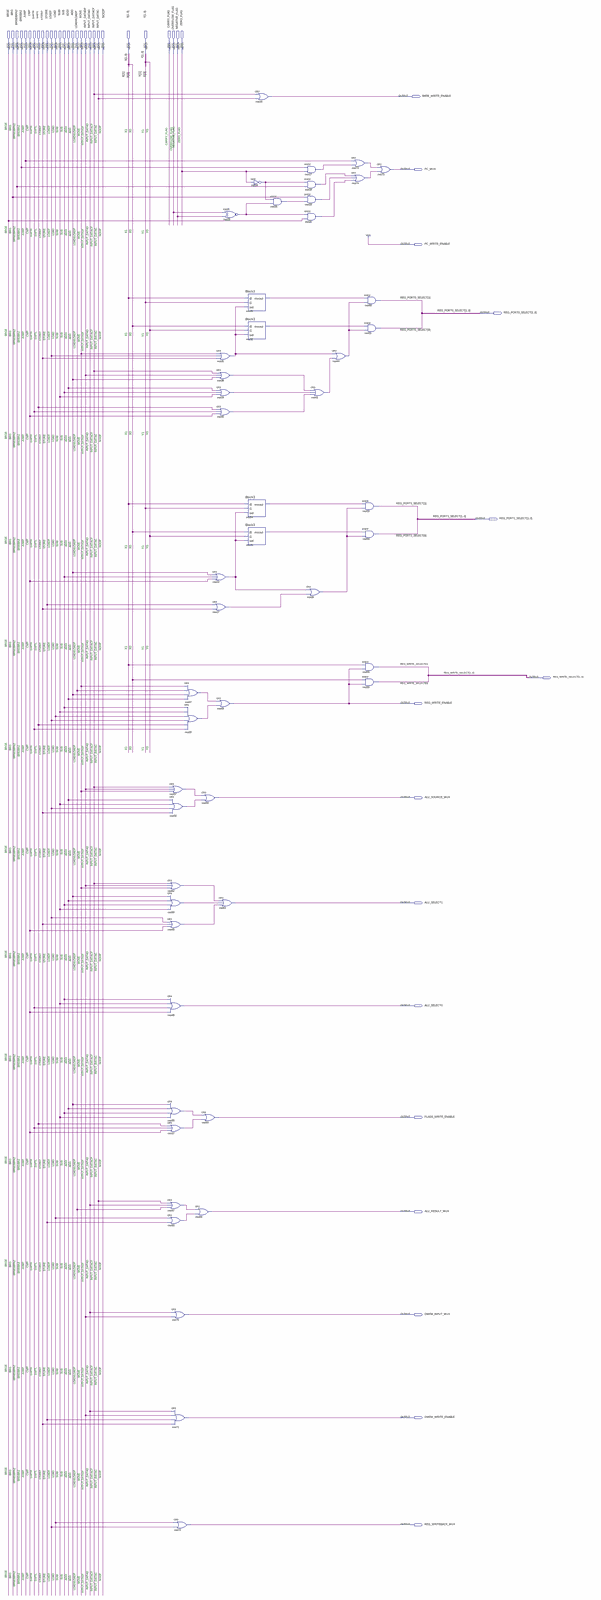
[diagram p0: schematic sheet, whole]
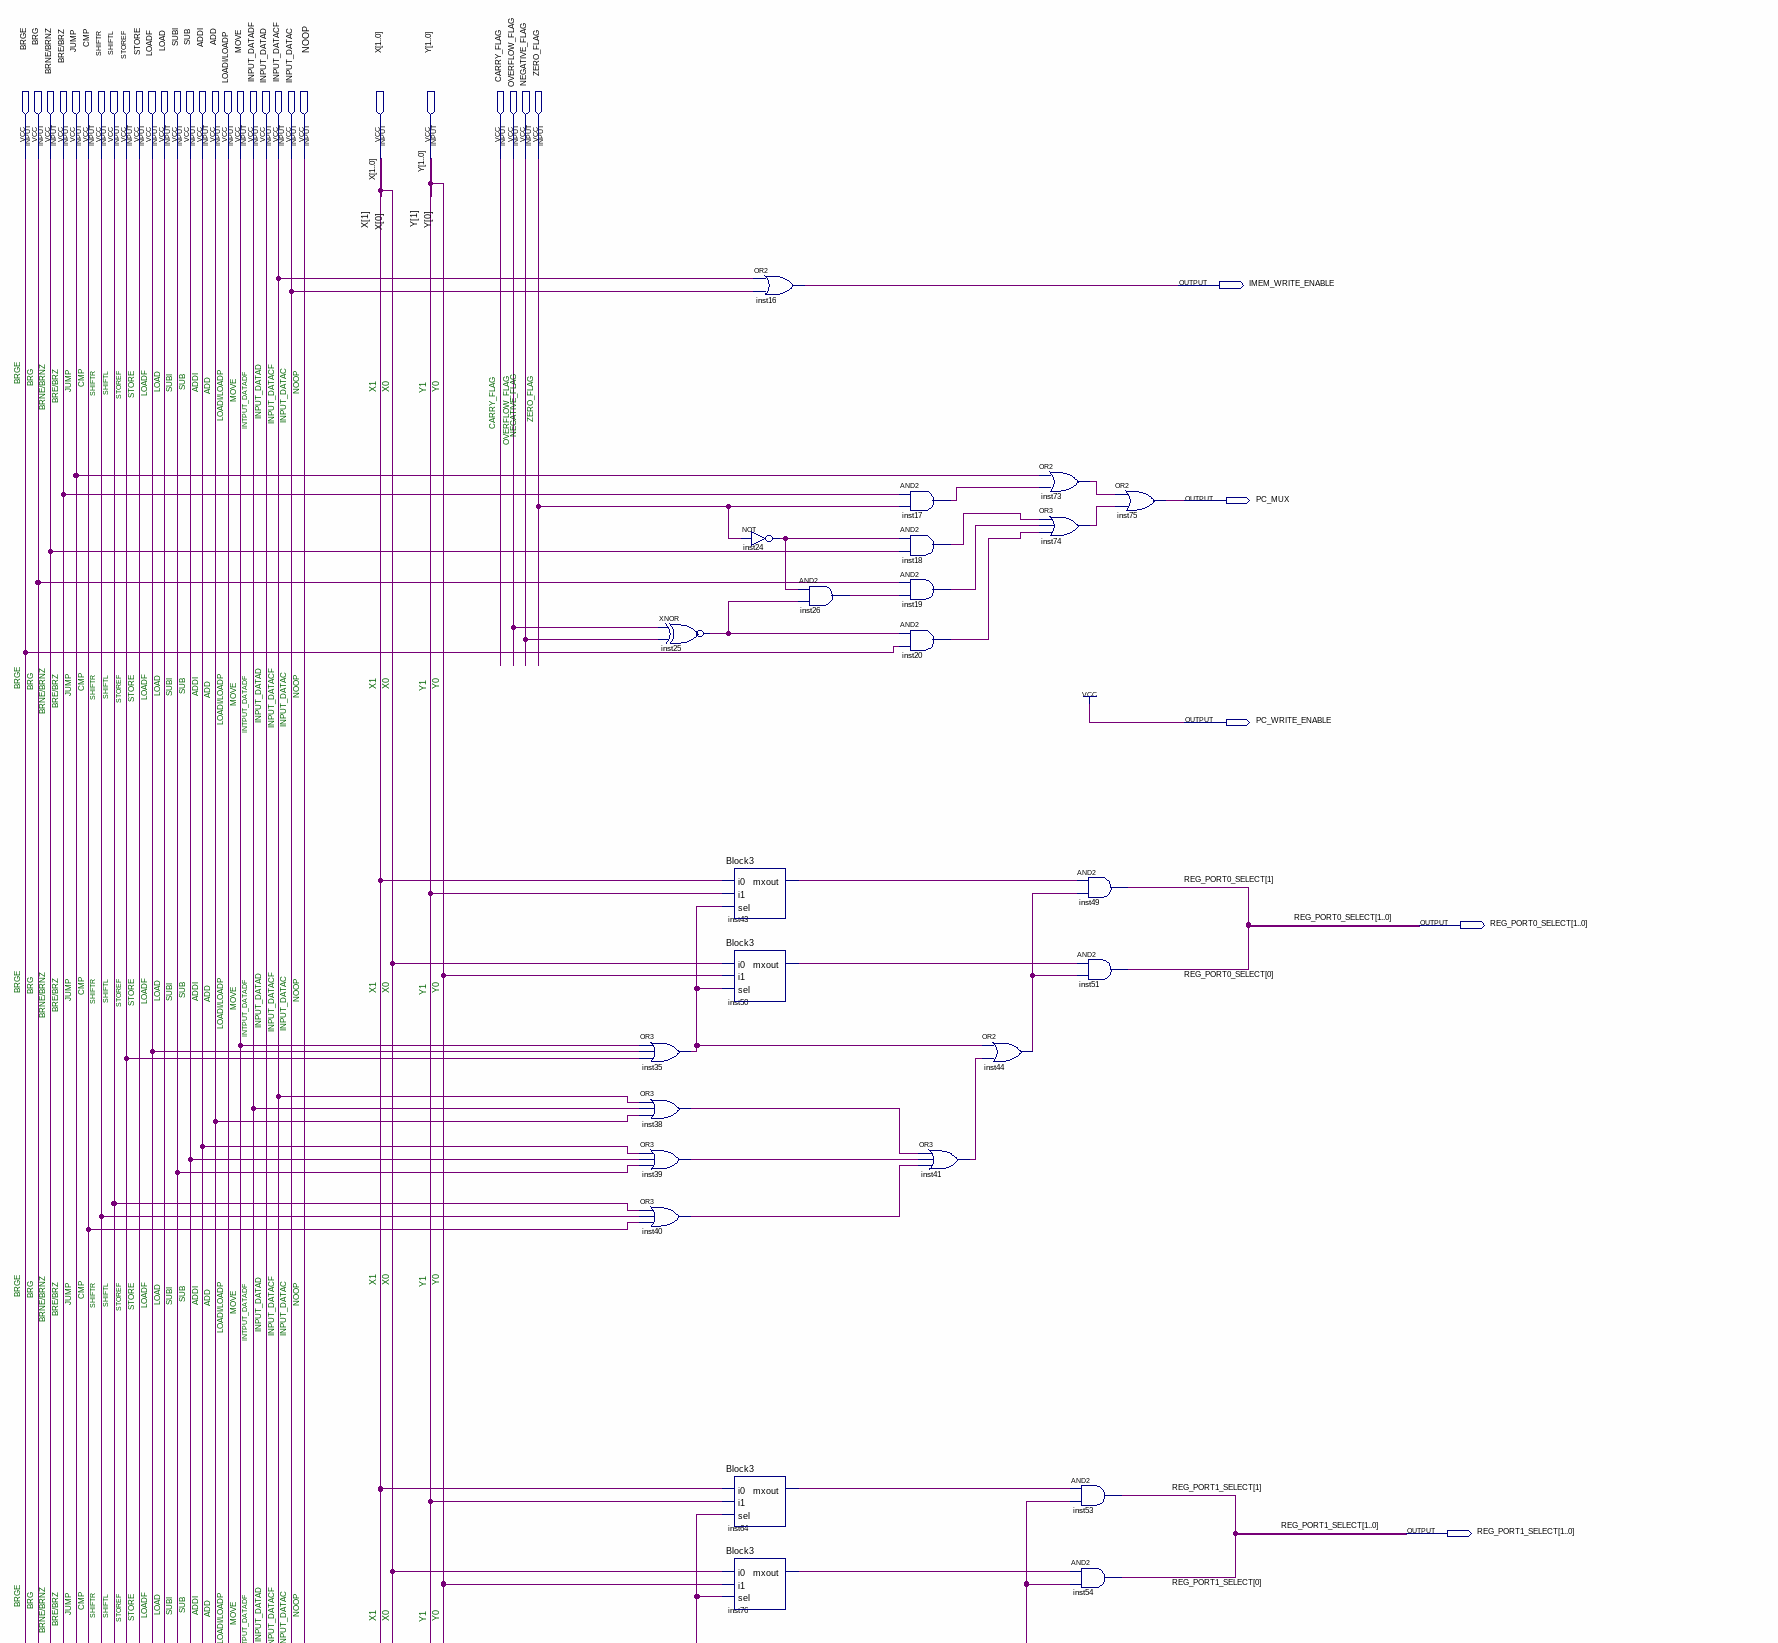
[diagram p1: schematic sheet, upper part]
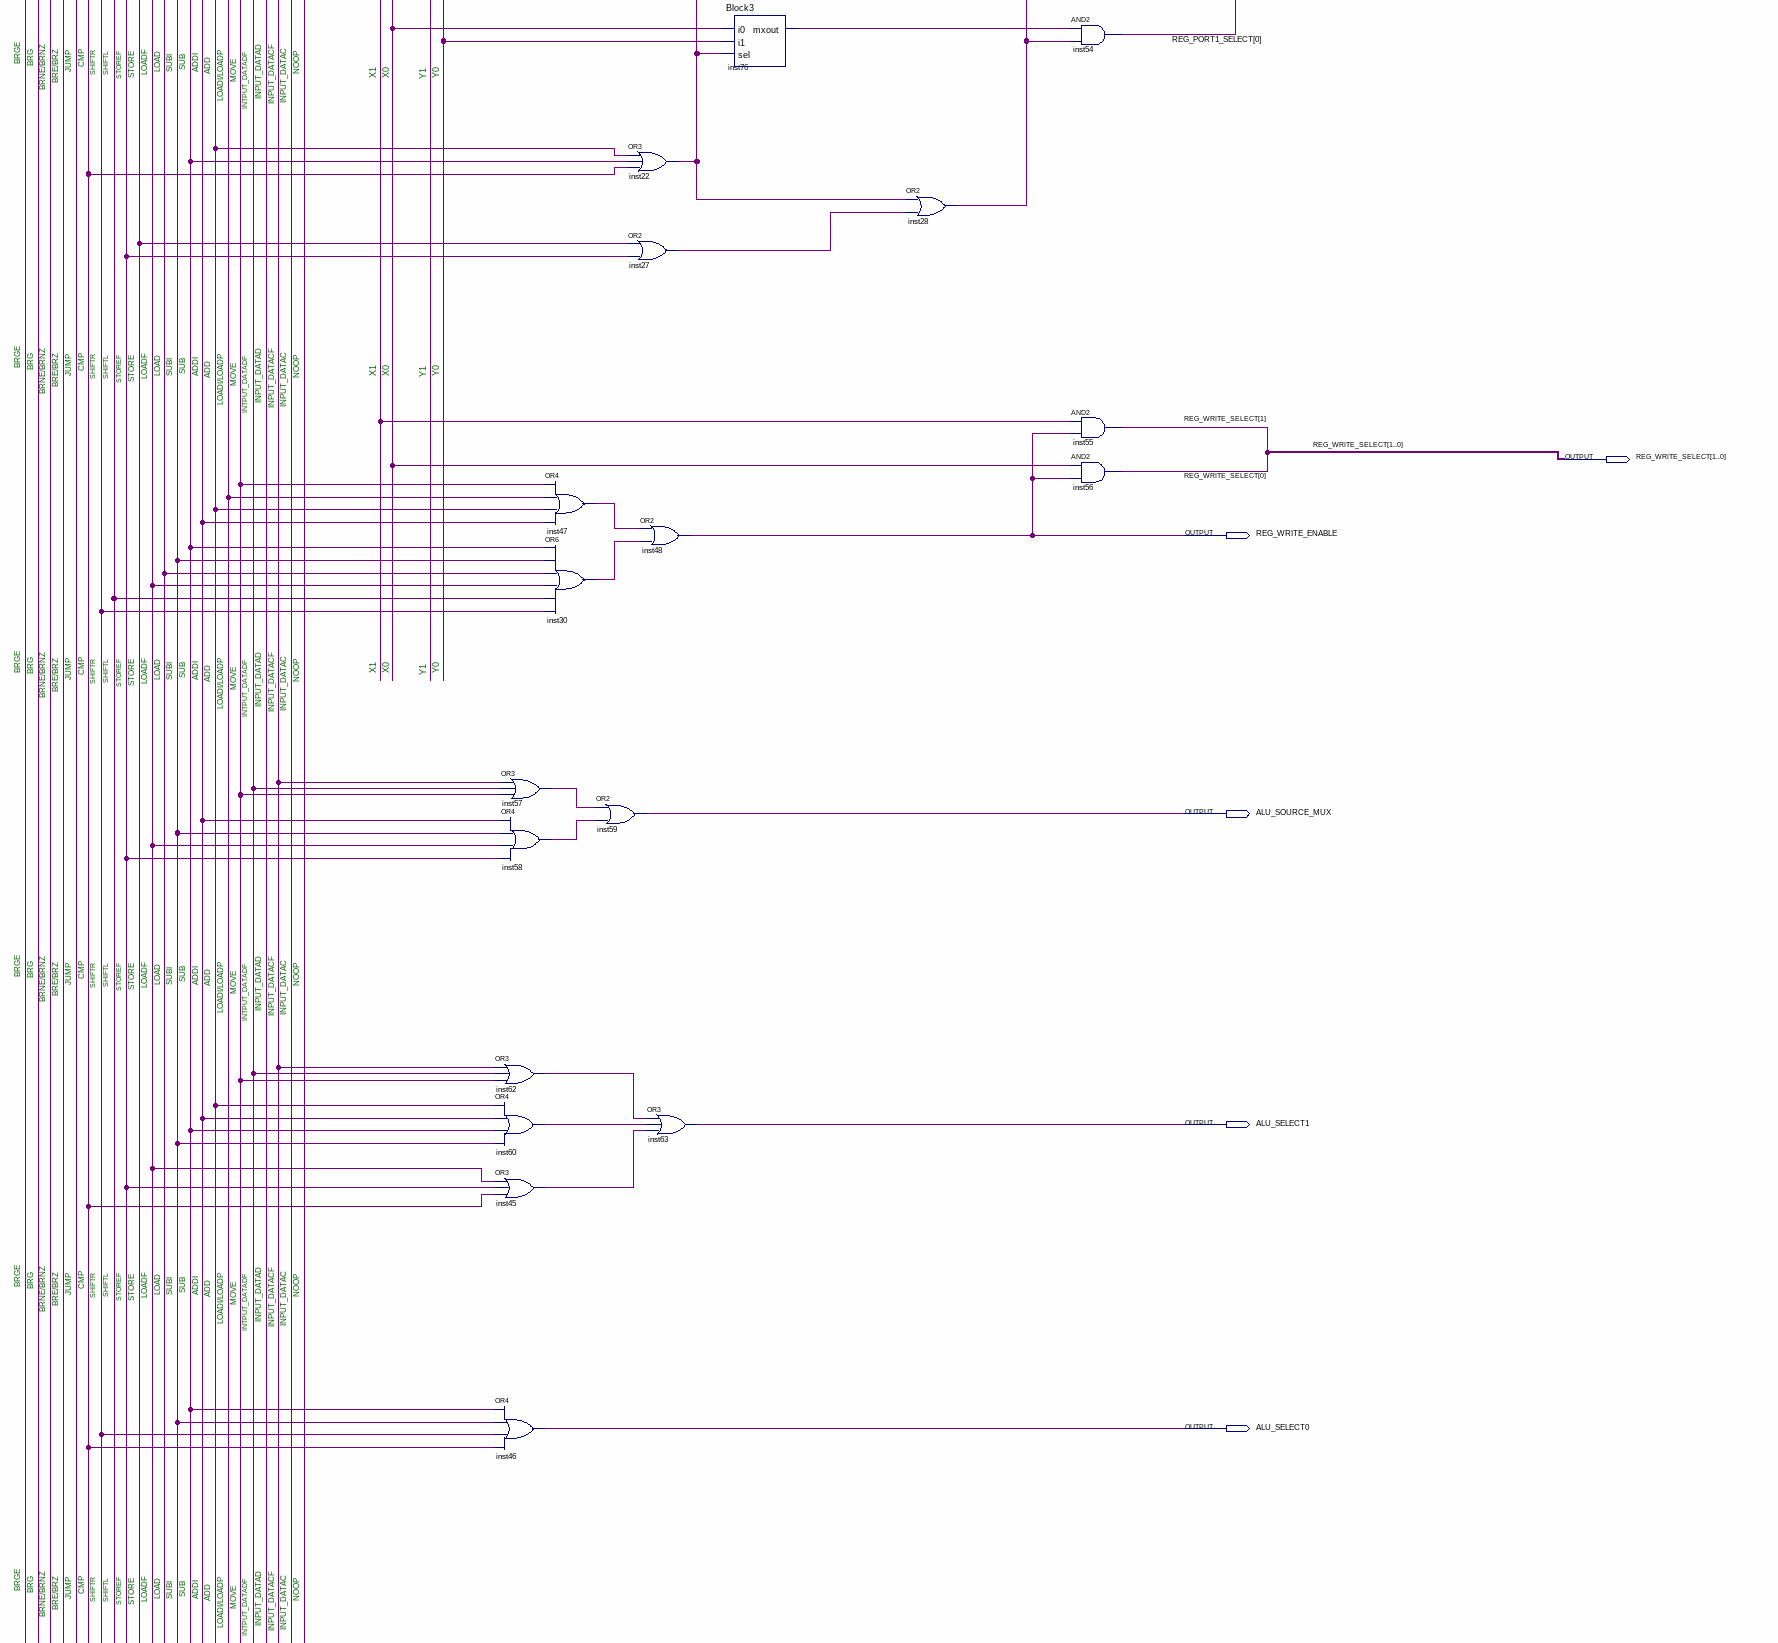
[diagram p2: schematic sheet, middle part]
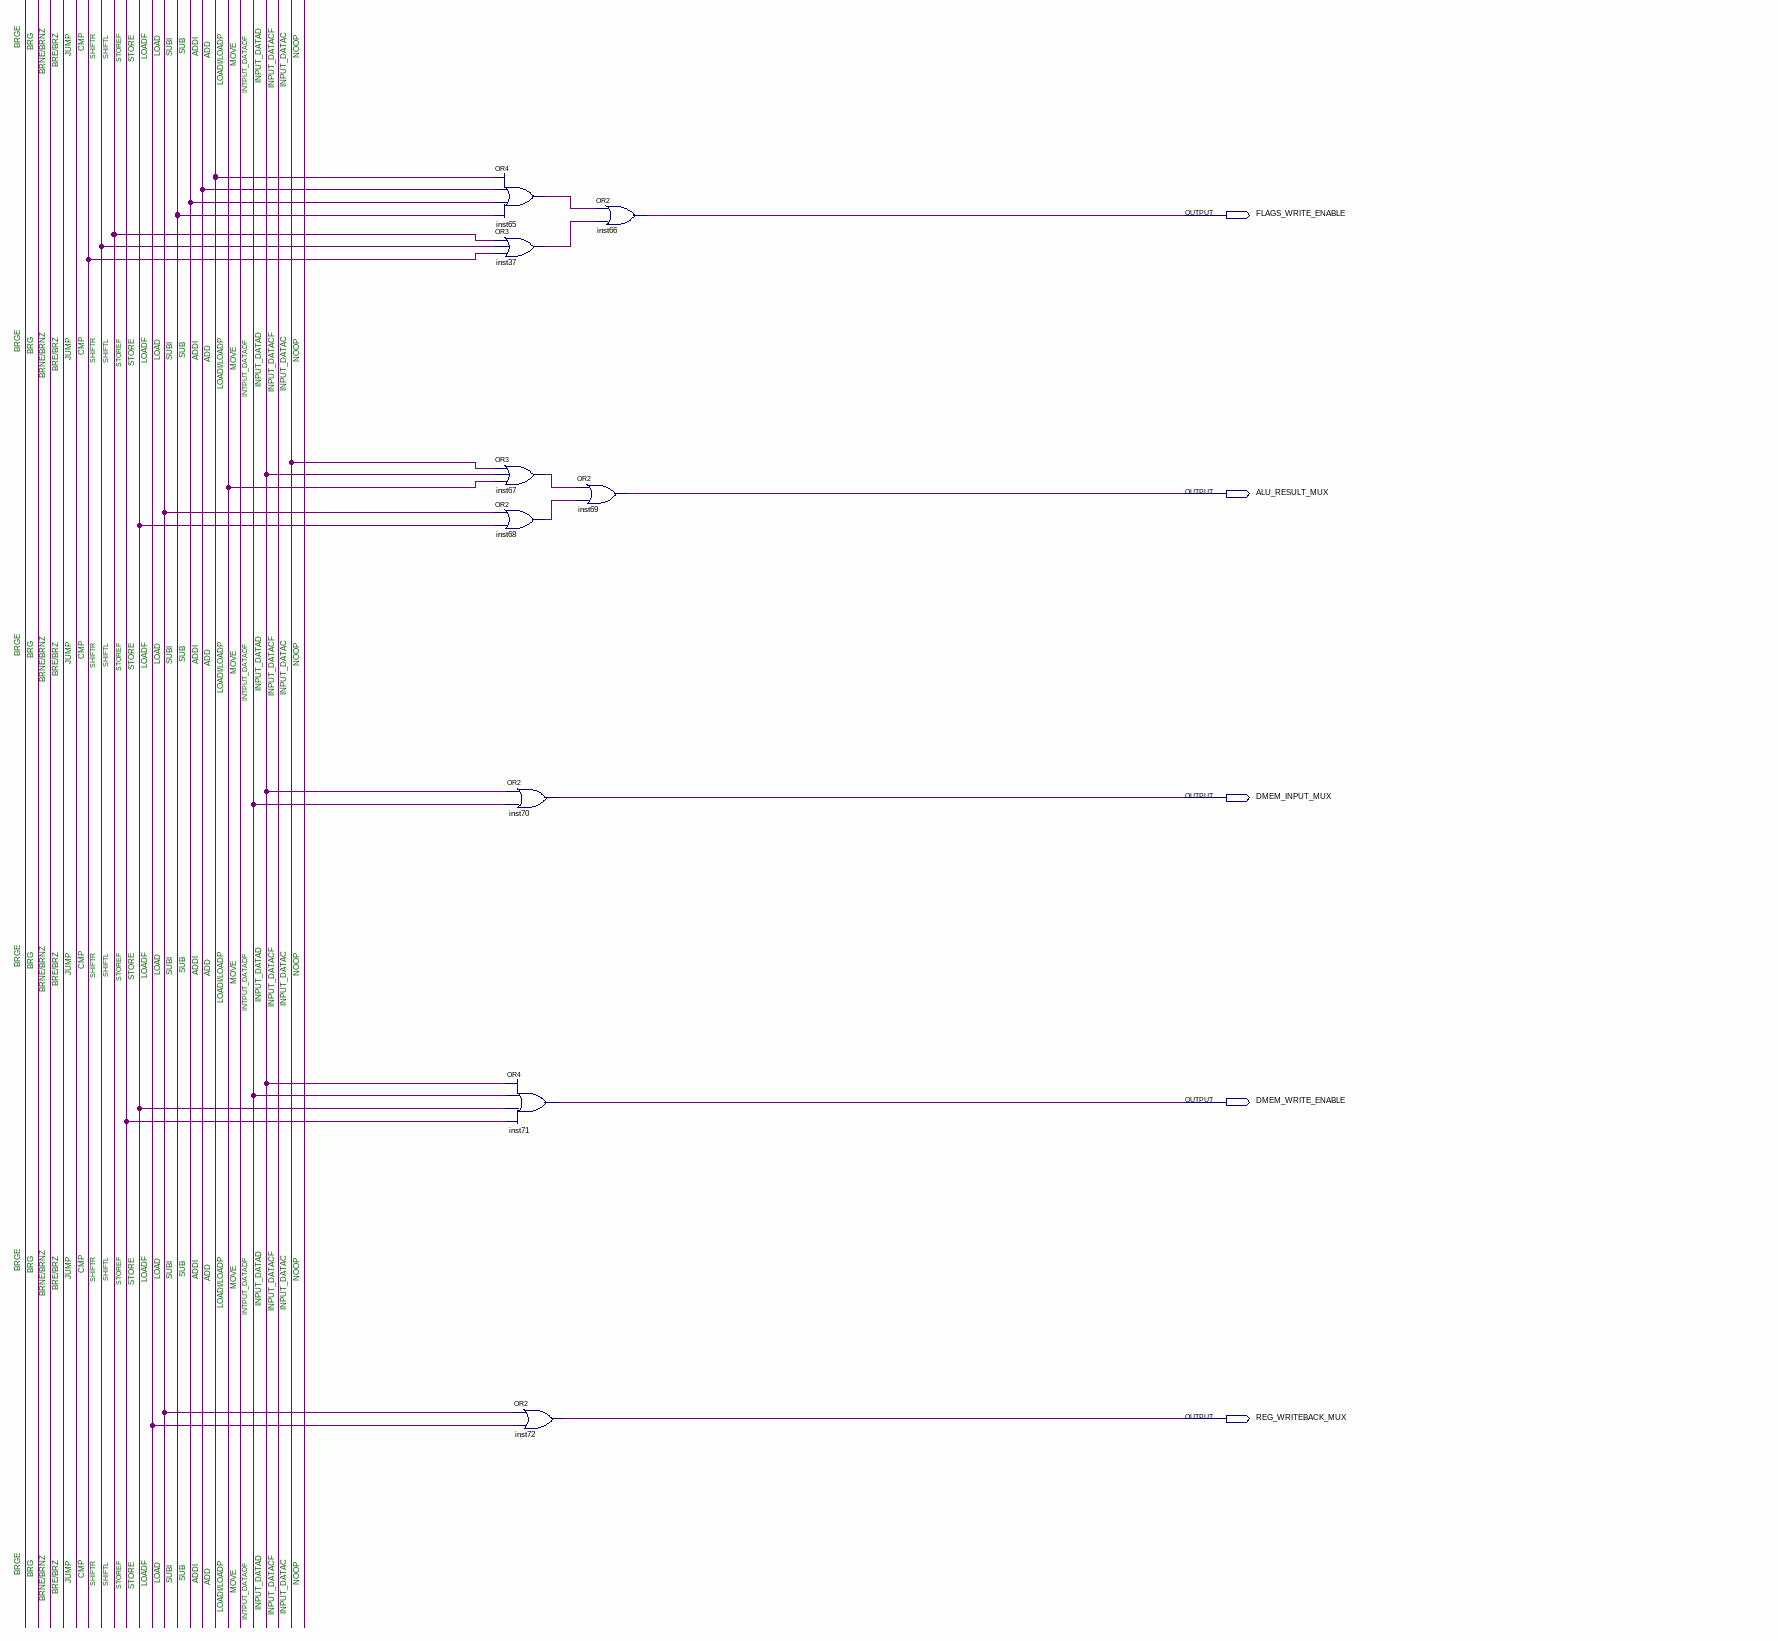
[diagram p3: schematic sheet, lower part]
// Quartus schematic Control_FSM.bdf as structural Verilog: 50 symbols, 44 pins
module Control_FSM (
  input  BRGE,
  input  BRG,
  input  \BRNE/BRNZ ,
  input  \BRE/BRZ ,
  input  JUMP,
  input  CMP,
  input  SHIFTR,
  input  SHIFTL,
  input  STOREF,
  input  STORE,
  input  LOADF,
  input  LOAD,
  input  SUBI,
  input  SUB,
  input  ADDI,
  input  ADD,
  input  \LOADI/LOADP ,
  input  MOVE,
  input  INPUT_DATADF,
  input  INPUT_DATAD,
  input  INPUT_DATACF,
  input  INPUT_DATAC,
  input  NOOP,
  input  [1:0] X,
  input  [1:0] Y,
  input  CARRY_FLAG,
  input  OVERFLOW_FLAG,
  input  NEGATIVE_FLAG,
  input  ZERO_FLAG,
  output IMEM_WRITE_ENABLE,
  output PC_MUX,
  output PC_WRITE_ENABLE,
  output [1:0] REG_PORT0_SELECT,
  output [1:0] REG_PORT1_SELECT,
  output [1:0] REG_WRITE_SELECT,
  output REG_WRITE_ENABLE,
  output ALU_SOURCE_MUX,
  output ALU_SELECT1,
  output ALU_SELECT0,
  output FLAGS_WRITE_ENABLE,
  output ALU_RESULT_MUX,
  output DMEM_INPUT_MUX,
  output DMEM_WRITE_ENABLE,
  output REG_WRITEBACK_MUX
);

  wire inst17_out, inst18_out, inst19_out, inst20_out, inst22_out, inst24_out, inst25_out, inst26_out,
       inst27_out, inst28_out, inst30_out, inst35_out, inst37_out, inst38_out, inst39_out, inst40_out,
       inst41_out, inst43_mxout, inst44_out, inst45_out, inst47_out, inst50_mxout, inst57_out, inst58_out,
       inst60_out, inst62_out, inst64_mxout, inst65_out, inst67_out, inst68_out, inst73_out, inst74_out,
       inst76_mxout;

  or inst57 (inst57_out, INPUT_DATACF, INPUT_DATADF, MOVE);
  or inst58 (inst58_out, ADDI, SUBI, LOADF, STOREF);
  or inst62 (inst62_out, INPUT_DATACF, INPUT_DATADF, MOVE);
  or inst60 (inst60_out, ADD, ADDI, SUB, SUBI);
  or inst45 (inst45_out, LOADF, STOREF, CMP);
  or inst46 (ALU_SELECT0, SUB, SUBI, SHIFTR, CMP);
  or inst65 (inst65_out, ADD, ADDI, SUB, SUBI);
  or inst37 (inst37_out, SHIFTL, SHIFTR, CMP);
  or inst67 (inst67_out, INPUT_DATAC, INPUT_DATAD, \LOADI/LOADP );
  or inst68 (inst68_out, LOAD, STORE);
  or inst70 (DMEM_INPUT_MUX, INPUT_DATAD, INPUT_DATADF);
  or inst71 (DMEM_WRITE_ENABLE, INPUT_DATAD, INPUT_DATADF, STORE, STOREF);
  or inst72 (REG_WRITEBACK_MUX, LOAD, LOADF);
  or inst47 (inst47_out, MOVE, \LOADI/LOADP , ADD, ADDI);
  or inst30 (inst30_out, SUB, SUBI, LOAD, LOADF, SHIFTL, SHIFTR);
  or inst69 (ALU_RESULT_MUX, inst67_out, inst68_out);
  or inst22 (inst22_out, ADD, SUB, CMP);
  or inst27 (inst27_out, STORE, STOREF);
  or inst59 (ALU_SOURCE_MUX, inst57_out, inst58_out);
  or inst66 (FLAGS_WRITE_ENABLE, inst65_out, inst37_out);
  xnor inst25 (inst25_out, OVERFLOW_FLAG, NEGATIVE_FLAG);
  or inst35 (inst35_out, MOVE, LOADF, STOREF);
  or inst38 (inst38_out, INPUT_DATACF, INPUT_DATADF, ADD);
  or inst39 (inst39_out, ADDI, SUB, SUBI);
  or inst40 (inst40_out, SHIFTL, SHIFTR, CMP);
  or inst48 (REG_WRITE_ENABLE, inst47_out, inst30_out);
  or inst63 (ALU_SELECT1, inst62_out, inst60_out, inst45_out);
  Block3 inst43 (.i0(X[1]), .i1(Y[1]), .sel(inst35_out), .mxout(inst43_mxout));
  Block3 inst50 (.i0(X[0]), .i1(Y[0]), .sel(inst35_out), .mxout(inst50_mxout));
  Block3 inst64 (.i0(X[1]), .i1(Y[1]), .sel(inst22_out), .mxout(inst64_mxout));
  Block3 inst76 (.i0(X[0]), .i1(Y[0]), .sel(inst22_out), .mxout(inst76_mxout));
  or inst16 (IMEM_WRITE_ENABLE, INPUT_DATACF, INPUT_DATAC);
  not inst24 (inst24_out, ZERO_FLAG);
  and inst26 (inst26_out, inst24_out, inst25_out);
  and inst17 (inst17_out, \BRE/BRZ , ZERO_FLAG);
  and inst18 (inst18_out, inst24_out, \BRNE/BRNZ );
  and inst19 (inst19_out, BRG, inst26_out);
  and inst20 (inst20_out, inst25_out, BRGE);
  or inst41 (inst41_out, inst38_out, inst39_out, inst40_out);
  or inst28 (inst28_out, inst22_out, inst27_out);
  or inst44 (inst44_out, inst35_out, inst41_out);
  or inst73 (inst73_out, JUMP, inst17_out);
  or inst74 (inst74_out, inst18_out, inst19_out, inst20_out);
  and inst49 (REG_PORT0_SELECT[1], inst43_mxout, inst44_out);
  and inst51 (REG_PORT0_SELECT[0], inst50_mxout, inst44_out);
  and inst53 (REG_PORT1_SELECT[1], inst64_mxout, inst28_out);
  and inst54 (REG_PORT1_SELECT[0], inst76_mxout, inst28_out);
  and inst55 (REG_WRITE_SELECT[1], X[1], REG_WRITE_ENABLE);
  and inst56 (REG_WRITE_SELECT[0], X[0], REG_WRITE_ENABLE);
  or inst75 (PC_MUX, inst73_out, inst74_out);

  assign PC_WRITE_ENABLE = 1'b1;

  // Notes on the sheet:
  //   BRGE
  //   BRNE/BRNZ
  //   INTPUT_DATADF
  //   INPUT_DATAD
  //   INPUT_DATACF
  //   LOADI/LOADP
  //   CMP
  //   SHIFTR
  //   SHIFTL
  //   STOREF
  //   LOADF
  //   INPUT_DATAC
  //   BRG
  //   BRE/BRZ
  //   JUMP
  //   LOAD
  //   NOOP
  //   STORE
  //   NEGATIVE_FLAG
  //   SUB
  //   ADDI
  //   OVERFLOW_FLAG
  //   SUBI
  //   ZERO_FLAG
  //   CARRY_FLAG
  //   ADD
  //   MOVE
  //   X1
  //   X0
  //   Y0
  //   Y1
  //   BRGE
  //   BRNE/BRNZ
  //   INTPUT_DATADF
  //   INPUT_DATAD
  //   INPUT_DATACF
  //   LOADI/LOADP
  //   CMP
  //   SHIFTR
  //   SHIFTL
  //   STOREF
  //   LOADF
  //   INPUT_DATAC
  //   BRG
  //   BRE/BRZ
  //   JUMP
  //   LOAD
  //   NOOP
  //   STORE
  //   SUB
  //   ADDI
  //   SUBI
  //   X1
  //   X0
  //   Y0
  //   ADD
  //   Y1
  //   MOVE
  //   BRGE
  //   BRNE/BRNZ
  //   INTPUT_DATADF
  //   INPUT_DATAD
  //   INPUT_DATACF
  //   LOADI/LOADP
  //   CMP
  //   SHIFTR
  //   SHIFTL
  //   STOREF
  //   LOADF
  //   INPUT_DATAC
  //   BRG
  //   BRE/BRZ
  //   JUMP
  //   LOAD
  //   NOOP
  //   STORE
  //   SUB
  //   ADDI
  //   SUBI
  //   X1
  //   X0
  //   Y0
  //   ADD
  //   Y1
  //   MOVE
  //   BRGE
  //   X1
  //   X0
  //   Y0
  //   BRNE/BRNZ
  //   INTPUT_DATADF
  //   INPUT_DATAD
  //   INPUT_DATACF
  //   Y1
  //   LOADI/LOADP
  //   CMP
  //   SHIFTR
  //   SHIFTL
  //   STOREF
  //   LOADF
  //   INPUT_DATAC
  //   BRG
  //   BRE/BRZ
  //   JUMP
  //   LOAD
  //   NOOP
  //   STORE
  //   SUB
  //   ADDI
  //   SUBI
  //   ADD
  //   MOVE
  //   BRGE
  //   BRNE/BRNZ
  //   INTPUT_DATADF
  //   INPUT_DATAD
  //   INPUT_DATACF
  //   LOADI/LOADP
  //   CMP
  //   SHIFTR
  //   SHIFTL
  //   STOREF
  //   LOADF
  //   INPUT_DATAC
  //   BRG
  //   BRE/BRZ
  //   JUMP
  //   LOAD
  //   NOOP
  //   STORE
  //   SUB
  //   ADDI
  //   SUBI
  //   ADD
  //   MOVE
  //   X1
  //   X0
  //   Y0
  //   Y1
  //   BRGE
  //   BRNE/BRNZ
  //   INTPUT_DATADF
  //   INPUT_DATAD
  //   INPUT_DATACF
  //   LOADI/LOADP
  //   CMP
  //   SHIFTR
  //   SHIFTL
  //   STOREF
  //   LOADF
  //   INPUT_DATAC
  //   BRG
  //   BRE/BRZ
  //   JUMP
  //   LOAD
  //   NOOP
  //   STORE
  //   SUB
  //   ADDI
  //   SUBI
  //   ADD
  //   MOVE
  //   X1
  //   X0
  //   Y0
  //   Y1
  //   BRGE
  //   BRNE/BRNZ
  //   INTPUT_DATADF
  //   INPUT_DATAD
  //   INPUT_DATACF
  //   LOADI/LOADP
  //   CMP
  //   SHIFTR
  //   SHIFTL
  //   STOREF
  //   LOADF
  //   INPUT_DATAC
  //   BRG
  //   BRE/BRZ
  //   JUMP
  //   LOAD
  //   NOOP
  //   STORE
  //   SUB
  //   ADDI
  //   SUBI
  //   X1
  //   X0
  //   Y0
  //   ADD
  //   Y1
  //   MOVE
  //   BRGE
  //   BRNE/BRNZ
  //   INTPUT_DATADF
  //   INPUT_DATAD
  //   INPUT_DATACF
  //   LOADI/LOADP
  //   CMP
  //   SHIFTR
  //   SHIFTL
  //   STOREF
  //   LOADF
  //   INPUT_DATAC
  //   BRG
  //   BRE/BRZ
  //   JUMP
  //   LOAD
  //   NOOP
  //   STORE
  //   SUB
  //   ADDI
  //   SUBI
  //   ADD
  //   MOVE
  //   BRGE
  //   BRNE/BRNZ
  //   INTPUT_DATADF
  //   INPUT_DATAD
  //   INPUT_DATACF
  //   LOADI/LOADP
  //   CMP
  //   SHIFTR
  //   SHIFTL
  //   STOREF
  //   LOADF
  //   INPUT_DATAC
  //   BRG
  //   BRE/BRZ
  //   JUMP
  //   LOAD
  //   NOOP
  //   STORE
  //   SUB
  //   ADDI
  //   SUBI
  //   ADD
  //   MOVE
  //   BRGE
  //   BRNE/BRNZ
  //   INTPUT_DATADF
  //   INPUT_DATAD
  //   INPUT_DATACF
  //   LOADI/LOADP
  //   CMP
  //   SHIFTR
  //   SHIFTL
  //   STOREF
  //   LOADF
  //   INPUT_DATAC
  //   BRG
  //   BRE/BRZ
  //   JUMP
  //   LOAD
  //   NOOP
  //   STORE
  //   SUB
  //   ADDI
  //   SUBI
  //   ADD
  //   MOVE
  //   BRGE
  //   BRNE/BRNZ
  //   INTPUT_DATADF
  //   INPUT_DATAD
  //   INPUT_DATACF
  //   LOADI/LOADP
  //   CMP
  //   SHIFTR
  //   SHIFTL
  //   STOREF
  //   LOADF
  //   INPUT_DATAC
  //   BRG
  //   BRE/BRZ
  //   JUMP
  //   LOAD
  //   NOOP
  //   STORE
  //   SUB
  //   ADDI
  //   SUBI
  //   ADD
  //   MOVE
  //   BRGE
  //   BRNE/BRNZ
  //   INTPUT_DATADF
  //   INPUT_DATAD
  //   INPUT_DATACF
  //   LOADI/LOADP
  //   CMP
  //   SHIFTR
  //   SHIFTL
  //   STOREF
  //   LOADF
  //   INPUT_DATAC
  //   BRG
  //   BRE/BRZ
  //   JUMP
  //   LOAD
  //   NOOP
  //   STORE
  //   SUB
  //   ADDI
  //   SUBI
  //   ADD
  //   MOVE
  //   BRGE
  //   BRNE/BRNZ
  //   INTPUT_DATADF
  //   INPUT_DATAD
  //   INPUT_DATACF
  //   LOADI/LOADP
  //   CMP
  //   SHIFTR
  //   SHIFTL
  //   STOREF
  //   LOADF
  //   INPUT_DATAC
  //   BRG
  //   BRE/BRZ
  //   JUMP
  //   LOAD
  //   NOOP
  //   STORE
  //   SUB
  //   ADDI
  //   SUBI
  //   ADD
  //   MOVE
  //   BRGE
  //   BRNE/BRNZ
  //   INTPUT_DATADF
  //   INPUT_DATAD
  //   INPUT_DATACF
  //   LOADI/LOADP
  //   CMP
  //   SHIFTR
  //   SHIFTL
  //   STOREF
  //   LOADF
  //   INPUT_DATAC
  //   BRG
  //   BRE/BRZ
  //   JUMP
  //   LOAD
  //   NOOP
  //   STORE
  //   SUB
  //   ADDI
  //   SUBI
  //   ADD
  //   MOVE
  //   BRGE
  //   BRNE/BRNZ
  //   INTPUT_DATADF
  //   INPUT_DATAD
  //   INPUT_DATACF
  //   LOADI/LOADP
  //   CMP
  //   SHIFTR
  //   SHIFTL
  //   STOREF
  //   LOADF
  //   INPUT_DATAC
  //   BRG
  //   BRE/BRZ
  //   JUMP
  //   LOAD
  //   NOOP
  //   STORE
  //   SUB
  //   ADDI
  //   SUBI
  //   ADD
  //   MOVE
endmodule
